# EAGLE schematic OOBD-Tiger_ISO-CAN (EAGLE 6.4)

## Sheet 1 of 6
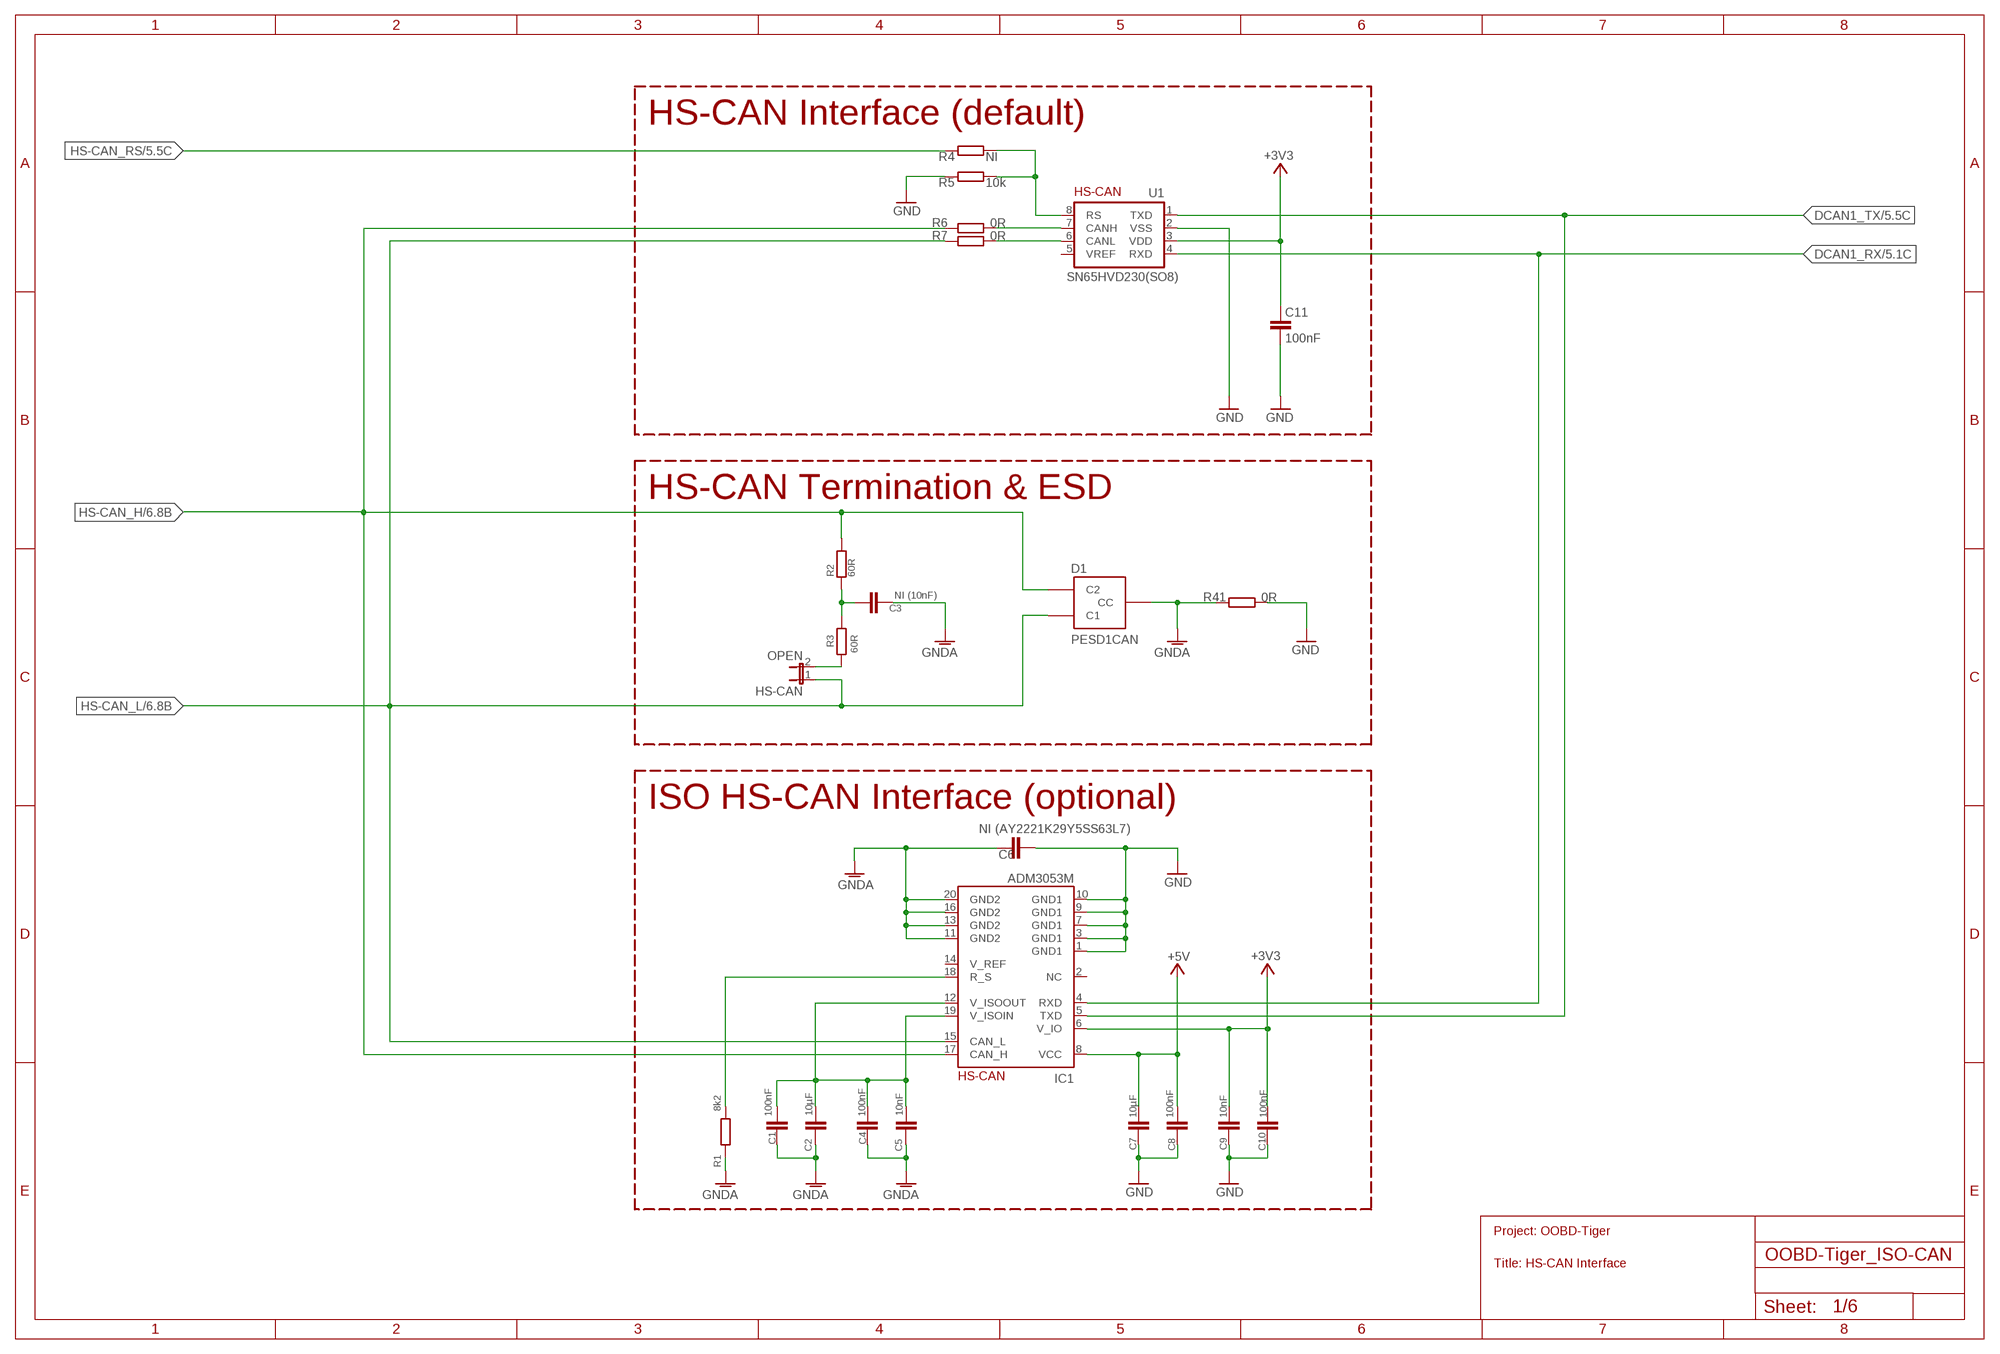
[diagram p0: schematic, sheet 1]

### Parts
C1  100nF  C-EUC0603K  [C0603K]
C2  10µF  C-EUC0805K  [C0805K]
C3  NI (10nF)  C-EUC0603  [C0603]
C4  100nF  C-EUC0603K  [C0603K]
C5  10nF  C-EUC0805K  [C0805K]
C6  NI (AY2221K29Y5SS63L7)  C-EU075-032X103  [C075-032X103]
C7  10µF  C-EUC0805K  [C0805K]
C8  100nF  C-EUC0603K  [C0603K]
C9  10nF  C-EUC0805K  [C0805K]
C10  100nF  C-EUC0603K  [C0603K]
C11  100nF  C-EUC0603K  [C0603K]
D1  PESD1CAN  [SOT23]
HS-CAN  OPEN  JUMPER-2PTH  [1X02]
IC1  ADM3053M  [SO20W]
R1  8k2  R-EU_R0603  [R0603]
R2  60R  R-EU_R0603  [R0603]
R3  60R  R-EU_R0603  [R0603]
R4  NI  R-EU_R0603  [R0603]
R5  10k  R-EU_R0603  [R0603]
R6  0R  R-EU_0207/10  [0207/10]
R7  0R  R-EU_0207/10  [0207/10]
R41  0R  R-EU_0207/10  [0207/10]
U1  SN65HVD230(SO8)  MCP2551  [SO-08]

### Nets
+3V3: C9.1 C10.1 C11.1 IC1.6(V_IO) U1.3(VDD) ; also sheet 2,4,6
+5V: C7.1 C8.1 IC1.8(VCC) ; also sheet 2,3,4,5,6
DCAN1_RX: IC1.4(RXD) U1.4(RXD) ; also sheet 5
DCAN1_TX: IC1.5(TXD) U1.1(TXD) ; also sheet 5
GND [PWR]: C6.2 C7.2 C8.2 C9.2 C10.2 C11.2 IC1.1(GND1) IC1.3(GND1) IC1.7(GND1) IC1.9(GND1) IC1.10(GND1) R5.2 R41.1 U1.2(VSS) ; also sheet 2,3,4,5,6
GNDA [PWR]: C1.2 C2.2 C3.2 C4.2 C5.2 C6.1 D1.3(CC) IC1.11(GND2) IC1.13(GND2) IC1.16(GND2) IC1.20(GND2) R1.1 R41.2 ; also sheet 2
HS-CAN_H: D1.2(C2) IC1.17(CAN_H) R2.2 R6.2 ; also sheet 6
HS-CAN_L: D1.1(C1) HS-CAN.1 IC1.15(CAN_L) R7.1 ; also sheet 6
HS-CAN_RS: R4.2 ; also sheet 5
N$2: C3.1 R2.1 R3.1
N$5: R4.1 R5.1 U1.8(RS)
N$30: HS-CAN.2 R3.2
N$31: C1.1 C2.1 C4.1 C5.1 IC1.12(V_ISOOUT) IC1.19(V_ISOIN)
N$41: R7.2 U1.6(CANL)
N$45: R6.1 U1.7(CANH)
N$52: IC1.18(R_S) R1.2
Unconnected: IC1.2(NC) IC1.14(V_REF) U1.5(VREF)

### Notes on the sheet
- HS-CAN Interface (default)
- HS-CAN
- HS-CAN Termination & ESD
- DCAN0_TX
- DCAN0_RX
- ISO HS-CAN Interface (optional)
- HS-CAN
- Project: OOBD-Tiger
- Title: HS-CAN Interface

## Sheet 2 of 6
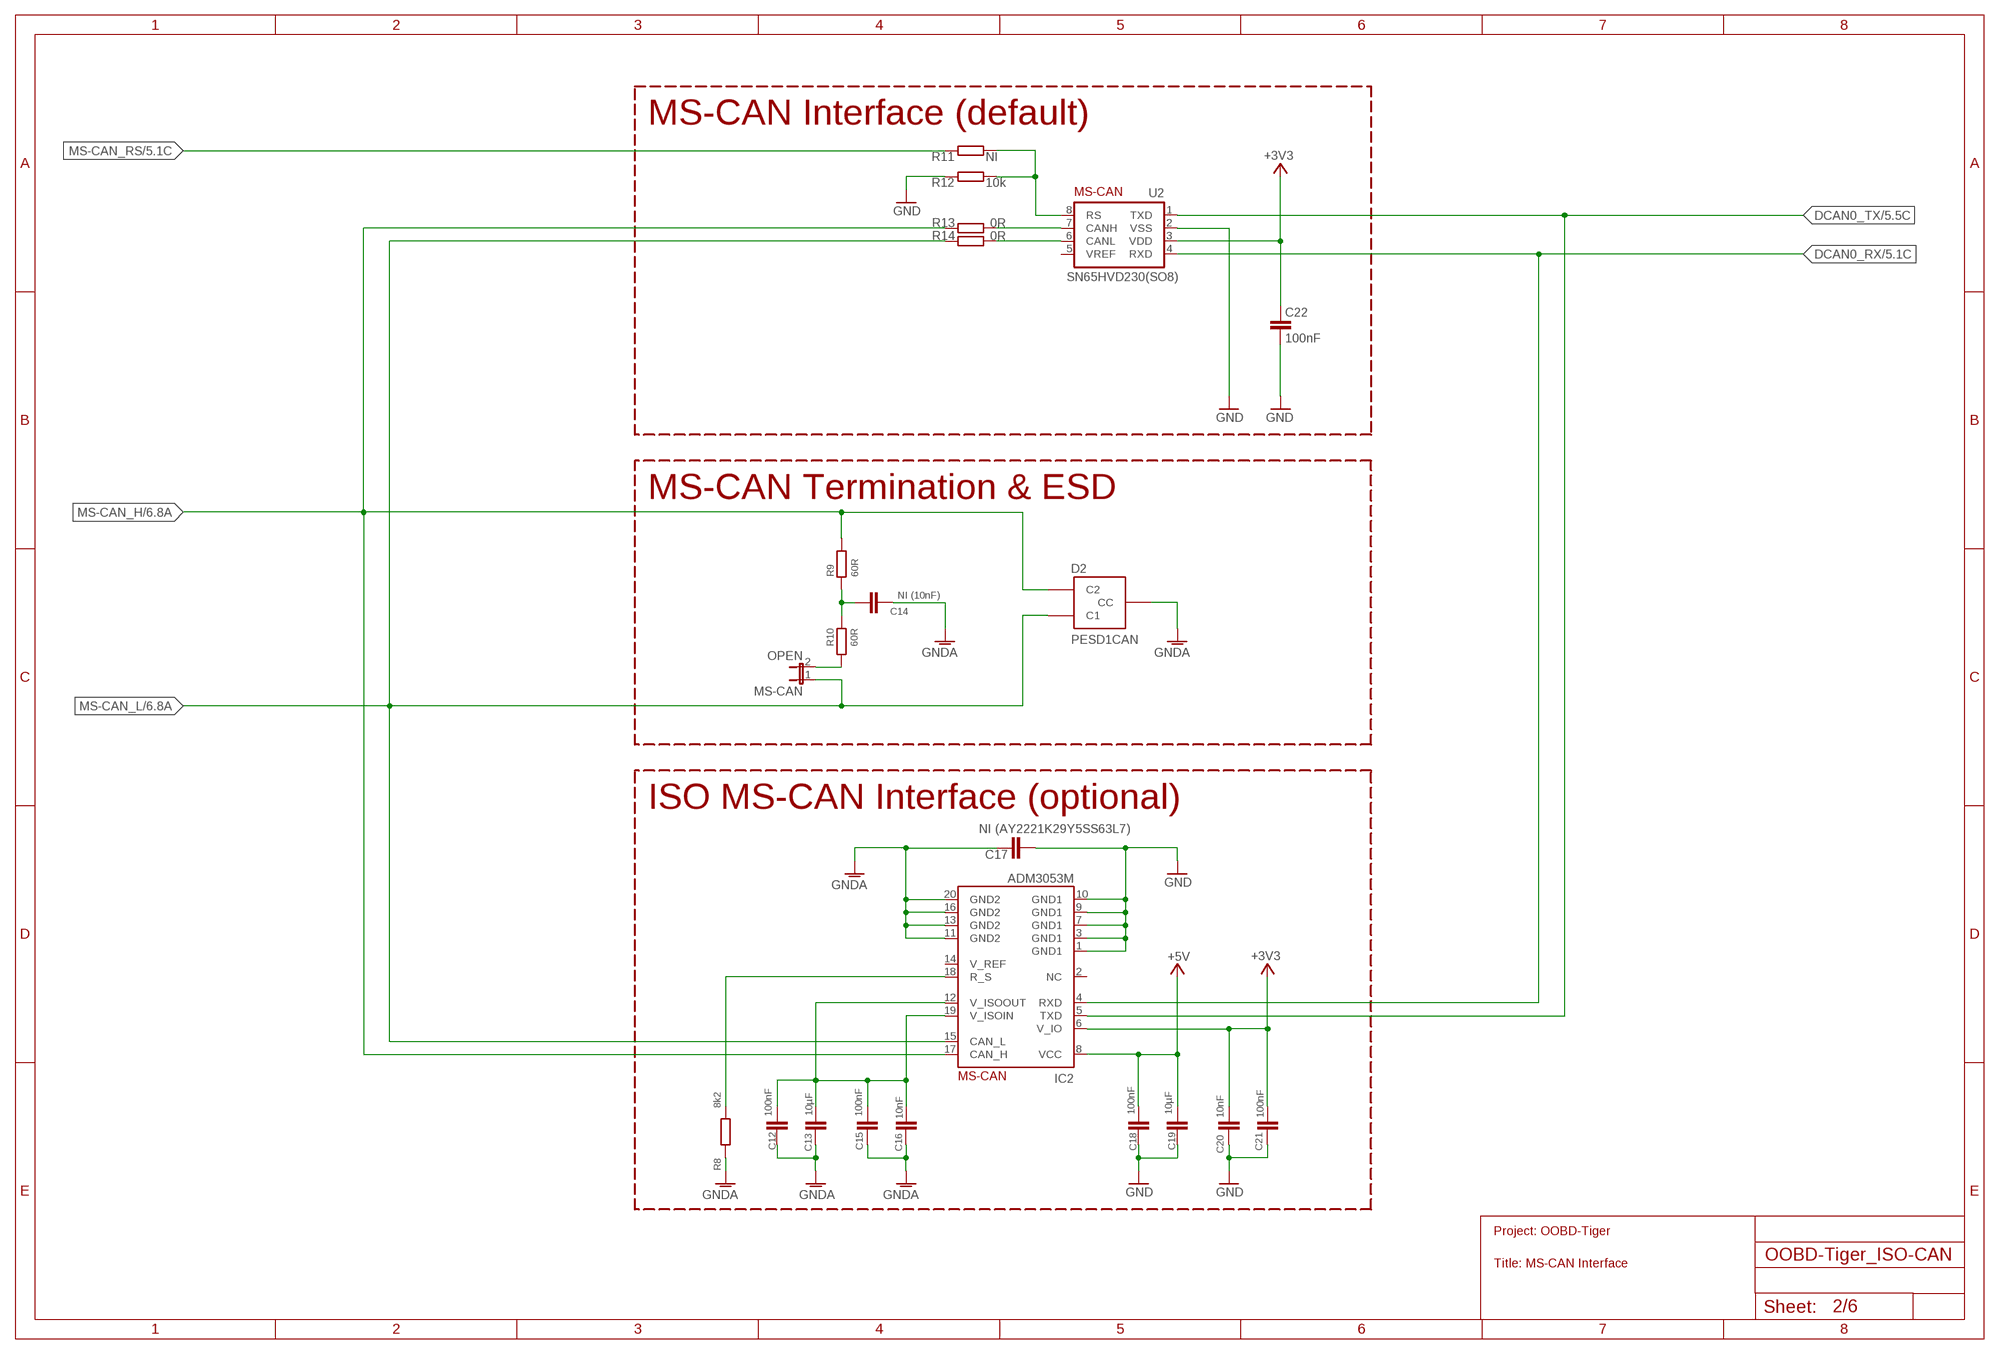
[diagram p1: schematic, sheet 2]

### Parts
C12  100nF  C-EUC0603K  [C0603K]
C13  10µF  C-EUC0805K  [C0805K]
C14  NI (10nF)  C-EUC0603  [C0603]
C15  100nF  C-EUC0603K  [C0603K]
C16  10nF  C-EUC0805K  [C0805K]
C17  NI (AY2221K29Y5SS63L7)  C-EU075-032X103  [C075-032X103]
C18  100nF  C-EUC0603K  [C0603K]
C19  10µF  C-EUC0805K  [C0805K]
C20  10nF  C-EUC0805K  [C0805K]
C21  100nF  C-EUC0603K  [C0603K]
C22  100nF  C-EUC0603K  [C0603K]
D2  PESD1CAN  [SOT23]
IC2  ADM3053M  [SO20W]
MS-CAN  OPEN  JUMPER-2PTH  [1X02]
R8  8k2  R-EU_R0603  [R0603]
R9  60R  R-EU_R0603  [R0603]
R10  60R  R-EU_R0603  [R0603]
R11  NI  R-EU_R0603  [R0603]
R12  10k  R-EU_R0603  [R0603]
R13  0R  R-EU_0207/10  [0207/10]
R14  0R  R-EU_0207/10  [0207/10]
U2  SN65HVD230(SO8)  MCP2551  [SO-08]

### Nets
+3V3: C20.1 C21.1 C22.1 IC2.6(V_IO) U2.3(VDD) ; also sheet 1,4,6
+5V: C18.1 C19.1 IC2.8(VCC) ; also sheet 1,3,4,5,6
DCAN0_RX: IC2.4(RXD) U2.4(RXD) ; also sheet 5
DCAN0_TX: IC2.5(TXD) U2.1(TXD) ; also sheet 5
GND [PWR]: C17.2 C18.2 C19.2 C20.2 C21.2 C22.2 IC2.1(GND1) IC2.3(GND1) IC2.7(GND1) IC2.9(GND1) IC2.10(GND1) R12.2 U2.2(VSS) ; also sheet 1,3,4,5,6
GNDA [PWR]: C12.2 C13.2 C14.2 C15.2 C16.2 C17.1 D2.3(CC) IC2.11(GND2) IC2.13(GND2) IC2.16(GND2) IC2.20(GND2) R8.1 ; also sheet 1
MS-CAN_H: D2.2(C2) IC2.17(CAN_H) R9.2 R13.1 ; also sheet 6
MS-CAN_L: D2.1(C1) IC2.15(CAN_L) MS-CAN.1 R14.1 ; also sheet 6
MS-CAN_RS: R11.2 ; also sheet 5
N$10: C14.1 R9.1 R10.1
N$32: MS-CAN.2 R10.2
N$33: IC2.18(R_S) R8.2
N$40: R13.2 U2.7(CANH)
N$42: R14.2 U2.6(CANL)
N$50: C12.1 C13.1 C15.1 C16.1 IC2.12(V_ISOOUT) IC2.19(V_ISOIN)
N$80: R11.1 R12.1 U2.8(RS)
Unconnected: IC2.2(NC) IC2.14(V_REF) U2.5(VREF)

### Notes on the sheet
- MS-CAN Interface (default)
- MS-CAN
- MS-CAN Termination & ESD
- ISO MS-CAN Interface (optional)
- MS-CAN
- Project: OOBD-Tiger
- Title: MS-CAN Interface

## Sheet 3 of 6
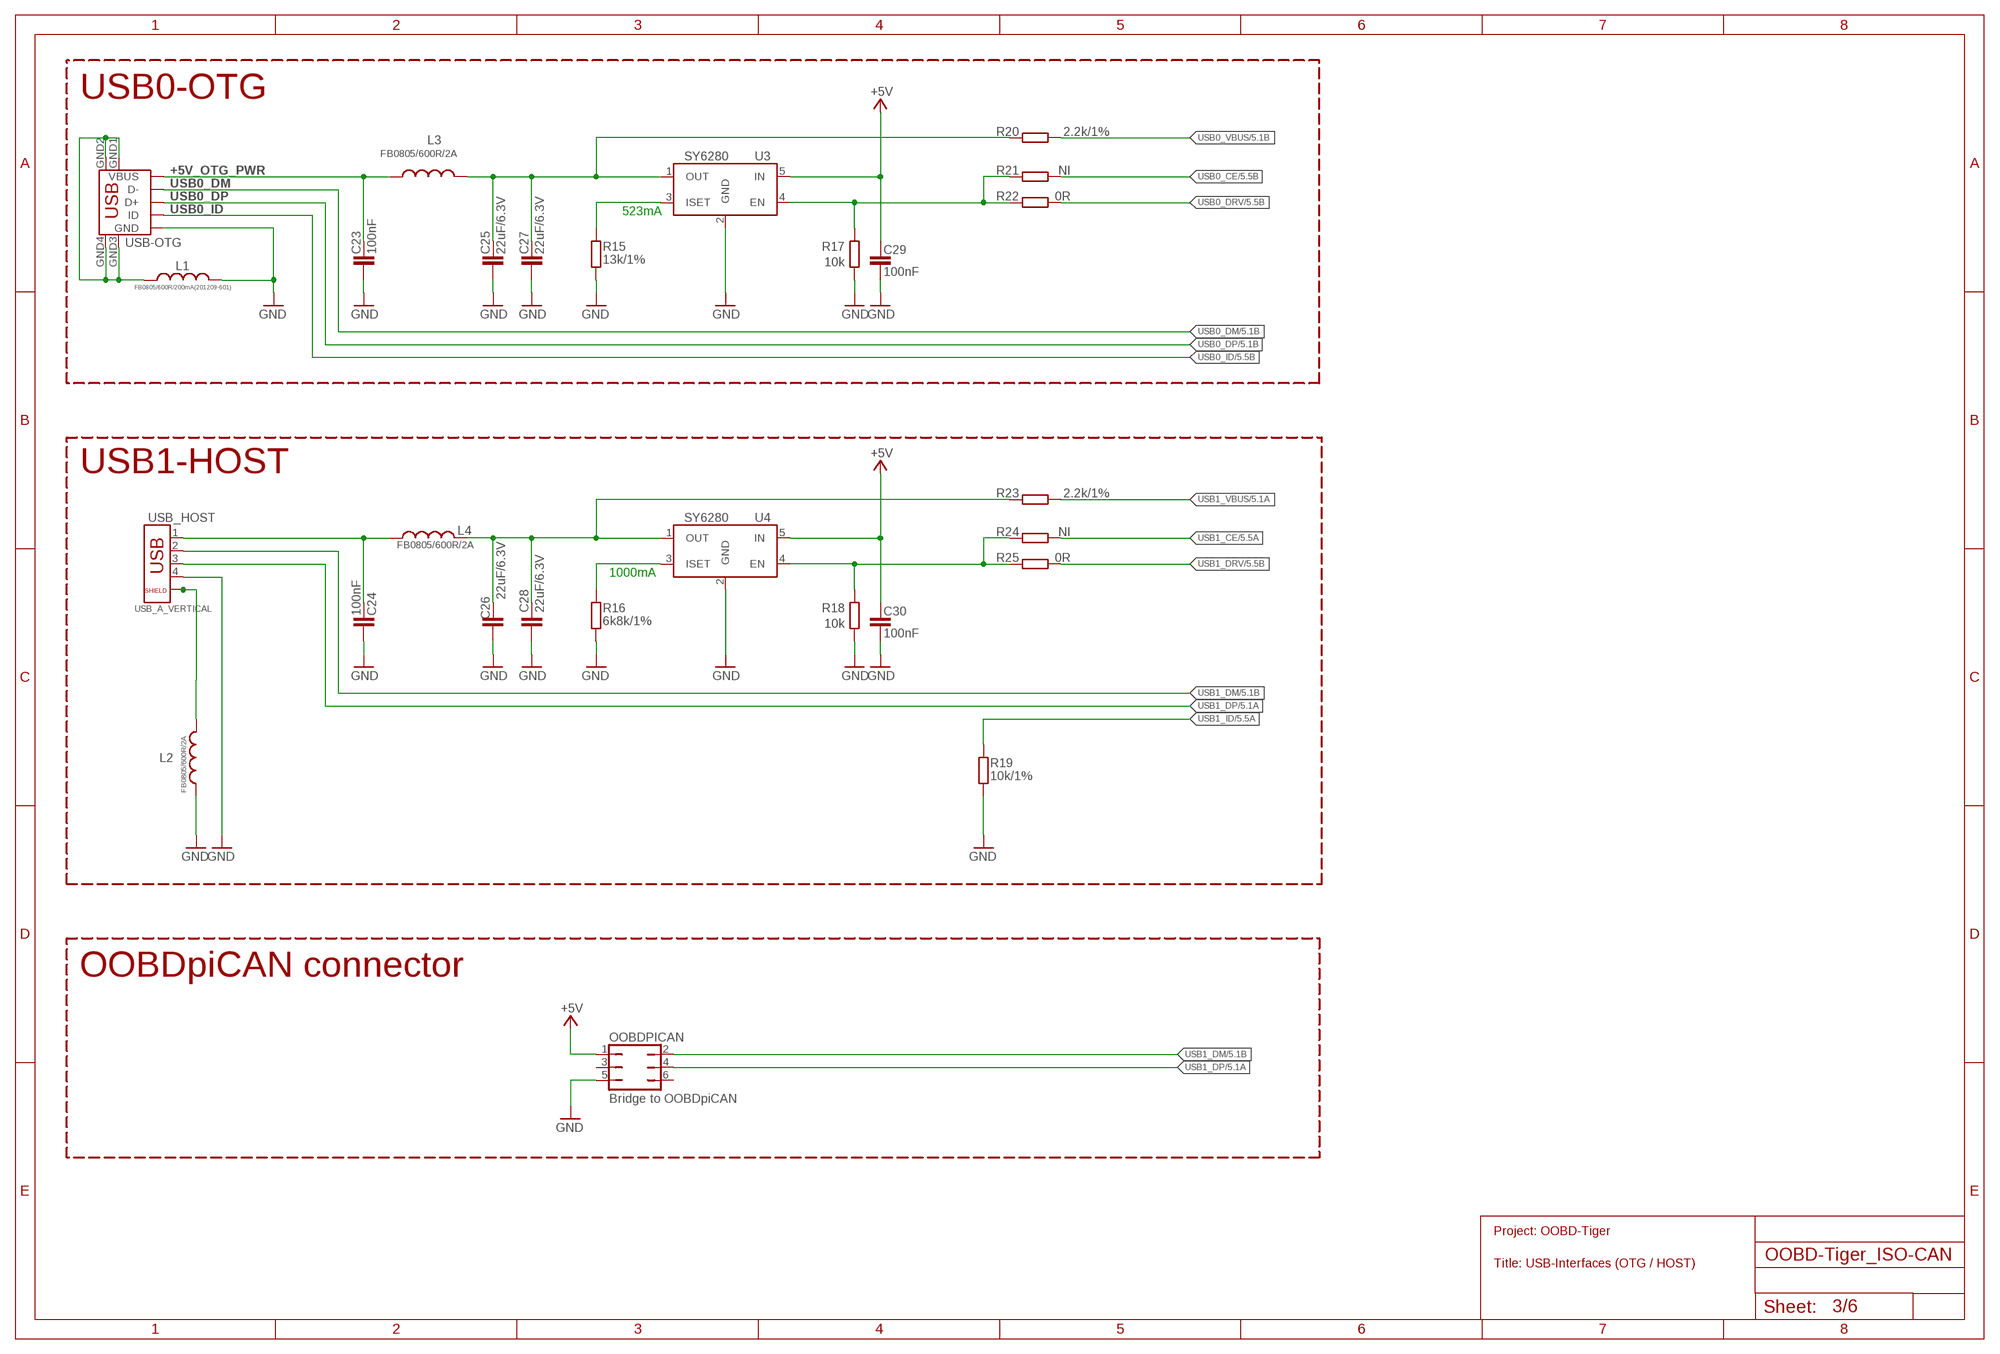
[diagram p2: schematic, sheet 3]

### Parts
C23  100nF  C-EUC0603K  [C0603K]
C24  100nF  C-EUC0603K  [C0603K]
C25  22uF/6.3V  C-EUC0603  [C0603]
C26  22uF/6.3V  C-EUC0603  [C0603]
C27  22uF/6.3V  C-EUC0603  [C0603]
C28  22uF/6.3V  C-EUC0603  [C0603]
C29  100nF  C-EUC0603K  [C0603K]
C30  100nF  C-EUC0603K  [C0603K]
L1  FB0805/600R/200mA(201209-601)  L-USL0603  [L0603]
L2  FB0805/600R/2A  L-USL0603  [L0603]
L3  FB0805/600R/2A  L-USL0603  [L0603]
L4  FB0805/600R/2A  L-USL0603  [L0603]
OOBDPICAN  Bridge to OOBDpiCAN  JP3Q  [JP3Q]
R15  13k/1%  R-EU_R0603  [R0603]
R16  6k8k/1%  R-EU_R0603  [R0603]
R17  10k  R-EU_R0603  [R0603]
R18  10k  R-EU_R0603  [R0603]
R19  10k/1%  R-EU_R0603  [R0603]
R20  2.2k/1%  R-EU_R0603  [R0603]
R21  NI  R-EU_R0603  [R0603]
R22  0R  R-EU_R0603  [R0603]
R23  2.2k/1%  R-EU_R0603  [R0603]
R24  NI  R-EU_R0603  [R0603]
R25  0R  R-EU_R0603  [R0603]
U3  SY6280  [SOT23-5]
U4  SY6280  [SOT23-5]
USB_HOST  USB_A_VERTICAL  USB_SHIELD1  [USB_PN87520_DEV_PTH]
USB_OTG  USB-OTG  MINI_USB9  [USB_MINI_9PIN]

### Nets
+5V: C29.1 C30.1 OOBDPICAN.1 U3.5(IN) U4.5(IN) ; also sheet 1,2,4,5,6
+5V_OTG_PWR: C23.1 L3.1 USB_OTG.VBUS
GND [PWR]: C23.2 C24.2 C25.2 C26.2 C27.2 C28.2 C29.2 C30.2 L1.1 L2.1 OOBDPICAN.5 R15.1 R16.1 R17.1 R18.1 R19.1 U3.2(GND) U4.2(GND) USB_HOST.4 USB_OTG.GND ; also sheet 1,2,4,5,6
N$3: R16.2 U4.3(ISET)
N$13: C26.1 C28.1 L4.1 R23.2 U4.1(OUT)
N$28: C24.1 L4.2 USB_HOST.1
N$29: L2.2 USB_HOST.P$1 USB_HOST.P$2
N$99: R15.2 U3.3(ISET)
N$100: C25.1 C27.1 L3.2 R20.2 U3.1(OUT)
N$266: L1.2 USB_OTG.GND1 USB_OTG.GND2 USB_OTG.GND3 USB_OTG.GND4
USB0_CE: R21.2 ; also sheet 5
USB0_DM: USB_OTG.D- ; also sheet 5
USB0_DP: USB_OTG.D+ ; also sheet 5
USB0_DRV: R22.2 ; also sheet 5
USB0_EN: R17.2 R21.1 R22.1 U3.4(EN)
USB0_ID: USB_OTG.ID ; also sheet 5
USB0_VBUS: R20.1 ; also sheet 5
USB1_CE: R24.2 ; also sheet 5
USB1_DM: OOBDPICAN.2 USB_HOST.2 ; also sheet 5
USB1_DP: OOBDPICAN.4 USB_HOST.3 ; also sheet 5
USB1_DRV: R25.2 ; also sheet 5
USB1_EN: R18.2 R24.1 R25.1 U4.4(EN)
USB1_ID: R19.2 ; also sheet 5
USB1_VBUS: R23.1 ; also sheet 5
Unconnected: OOBDPICAN.3 OOBDPICAN.6

### Notes on the sheet
- USB0-OTG
- 523mA
- Iset = 6800/Rs
- Rs
- Iset = 523mA
- USB1-HOST
- 1000mA
- OOBDpiCAN connector
- Project: OOBD-Tiger
- Title: USB-Interfaces (OTG / HOST)

## Sheet 4 of 6
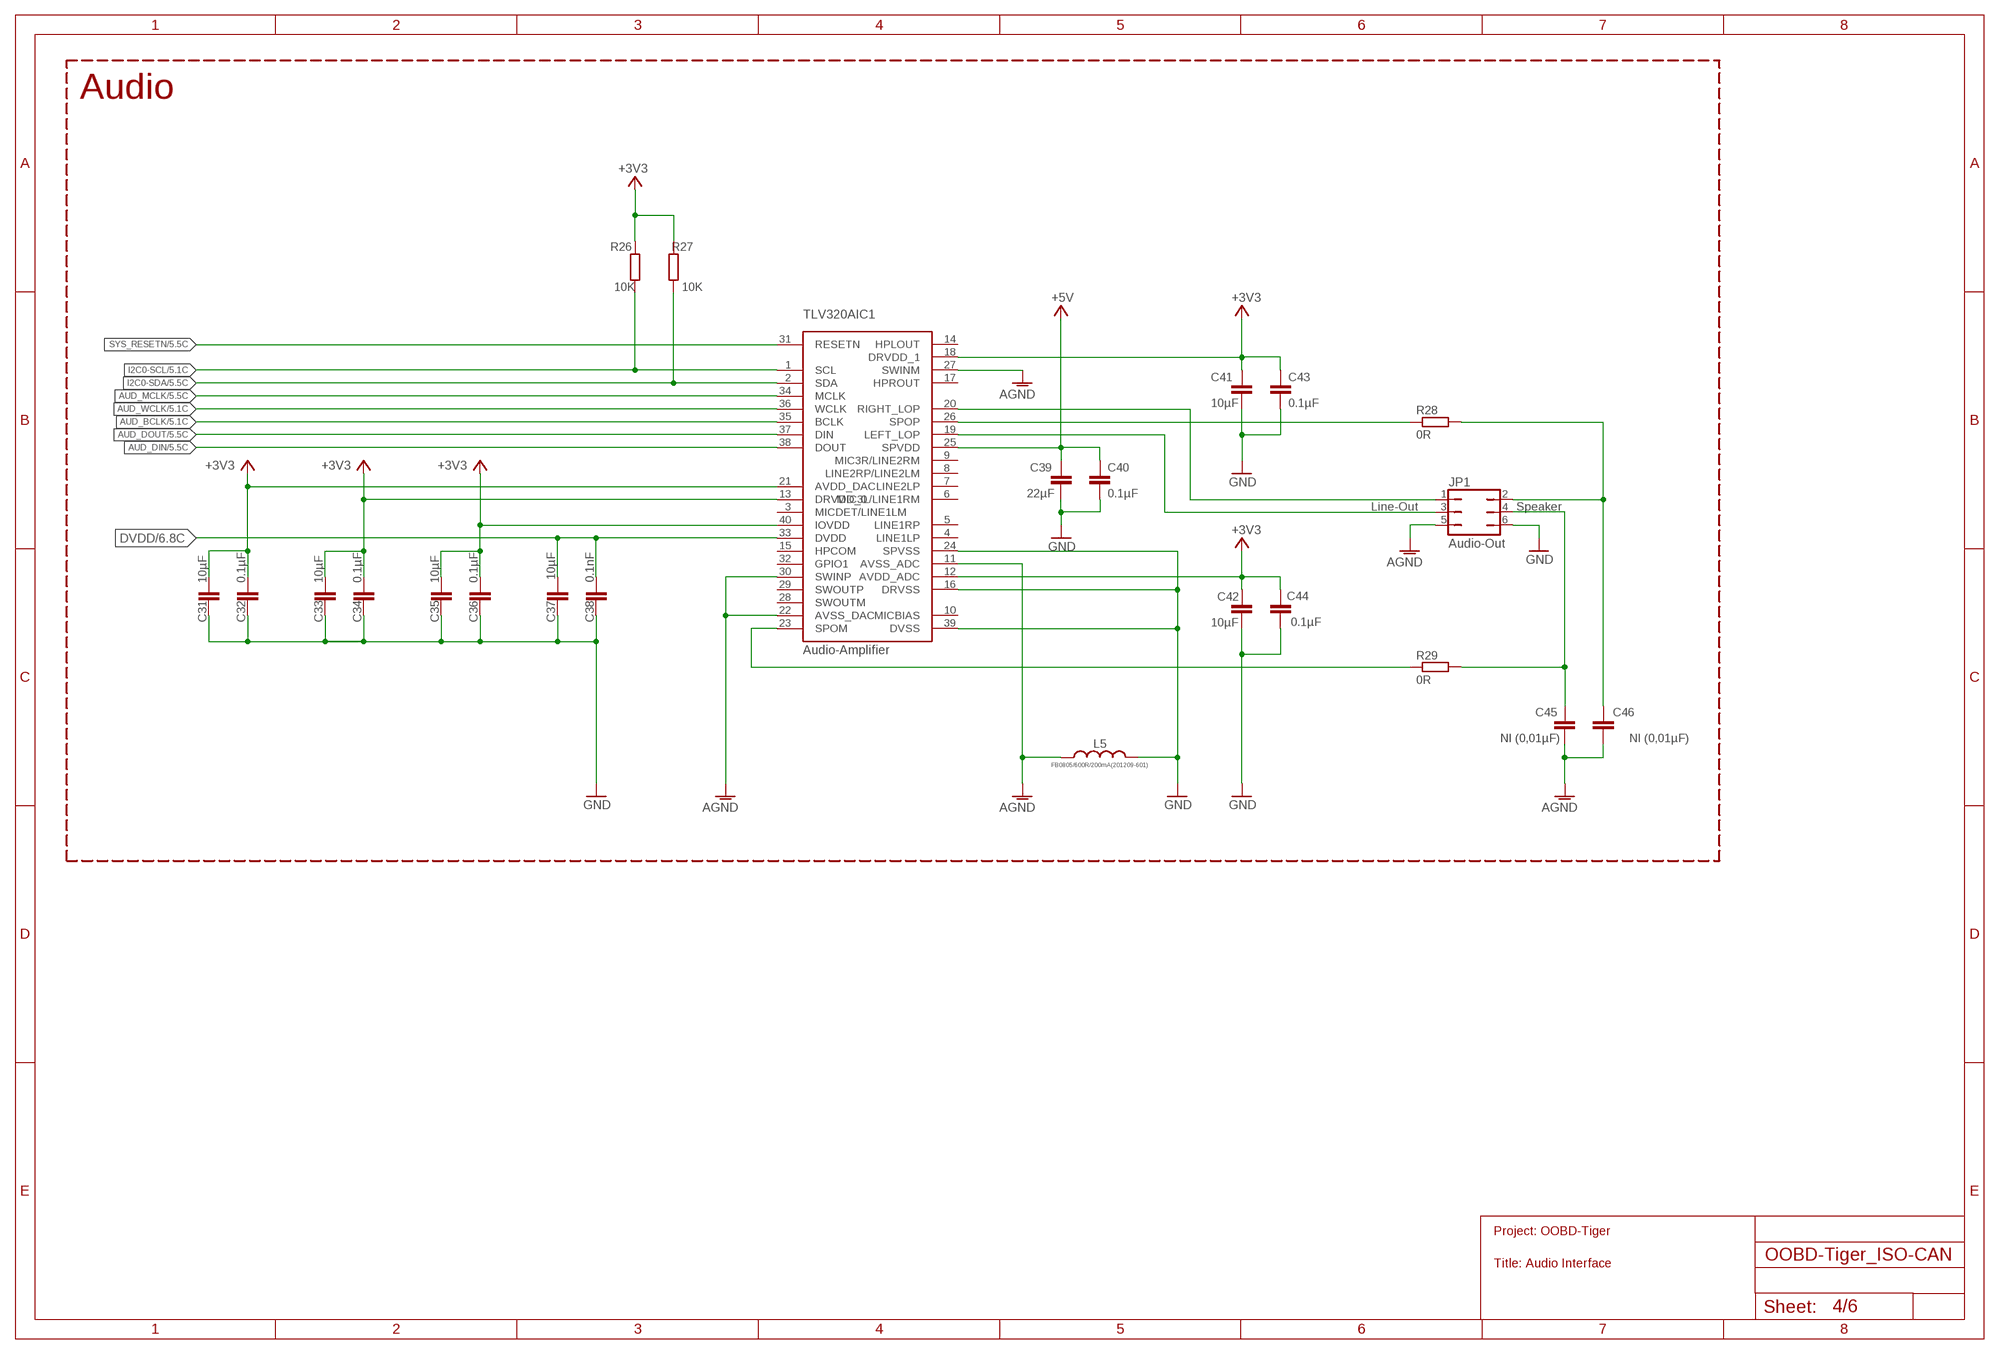
[diagram p3: schematic, sheet 4]

### Parts
C31  10µF  CAP0603-CAP  [0603-CAP]
C32  0.1µF  CAP0603-CAP  [0603-CAP]
C33  10µF  CAP0603-CAP  [0603-CAP]
C34  0.1µF  CAP0603-CAP  [0603-CAP]
C35  10µF  CAP0603-CAP  [0603-CAP]
C36  0.1µF  CAP0603-CAP  [0603-CAP]
C37  10µF  CAP0603-CAP  [0603-CAP]
C38  0.1nF  CAP0603-CAP  [0603-CAP]
C39  22µF  CAP0603-CAP  [0603-CAP]
C40  0.1µF  CAP0603-CAP  [0603-CAP]
C41  10µF  CAP0603-CAP  [0603-CAP]
C42  10µF  CAP0603-CAP  [0603-CAP]
C43  0.1µF  CAP0603-CAP  [0603-CAP]
C44  0.1µF  CAP0603-CAP  [0603-CAP]
C45  NI (0,01µF)  CAP0603-CAP  [0603-CAP]
C46  NI (0,01µF)  CAP0603-CAP  [0603-CAP]
JP1  Audio-Out  JP3Q  [JP3Q]
L5  FB0805/600R/200mA(201209-601)  L-USL0603  [L0603]
R26  10K  R-EU_R0603  [R0603]
R27  10K  R-EU_R0603  [R0603]
R28  0R  R-EU_R0805  [R0805]
R29  0R  R-EU_R0805  [R0805]
TLV320AIC1  Audio-Amplifier  TLV320AIC3107  [QFN40-6X6]

### Nets
+3V3: C31.2 C32.2 C33.2 C34.2 C35.2 C36.2 C41.1 C42.1 C43.1 C44.1 R26.2 R27.2 TLV320AIC1.12(AVDD_ADC) TLV320AIC1.13(DRVDD_0) TLV320AIC1.18(DRVDD_1) TLV320AIC1.21(AVDD_DAC) TLV320AIC1.40(IOVDD) ; also sheet 1,2,6
+5V: C39.2 C40.2 TLV320AIC1.25(SPVDD) ; also sheet 1,2,3,5,6
AGND: C45.1 C46.1 JP1.5 L5.2 TLV320AIC1.11(AVSS_ADC) TLV320AIC1.22(AVSS_DAC) TLV320AIC1.27(SWINM) TLV320AIC1.30(SWINP)
AUD_BCLK: TLV320AIC1.35(BCLK) ; also sheet 5
AUD_DIN: TLV320AIC1.38(DOUT) ; also sheet 5
AUD_DOUT: TLV320AIC1.37(DIN) ; also sheet 5
AUD_MCLK: TLV320AIC1.34(MCLK) ; also sheet 5
AUD_WCLK: TLV320AIC1.36(WCLK) ; also sheet 5
DVDD: C37.2 C38.2 TLV320AIC1.33(DVDD) ; also sheet 6
GND [PWR]: C31.1 C32.1 C33.1 C34.1 C35.1 C36.1 C37.1 C38.1 C39.1 C40.1 C41.2 C42.2 C43.2 C44.2 JP1.6 L5.1 TLV320AIC1.16(DRVSS) TLV320AIC1.24(SPVSS) TLV320AIC1.39(DVSS) ; also sheet 1,2,3,5,6
I2C0-SCL: R26.1 TLV320AIC1.1(SCL) ; also sheet 5,6
I2C0-SDA: R27.1 TLV320AIC1.2(SDA) ; also sheet 5,6
N$14: JP1.1 TLV320AIC1.20(RIGHT_LOP)
N$15: C45.2 JP1.4 R29.2
N$16: C46.2 JP1.2 R28.2
N$17 [PWR]: R28.1 TLV320AIC1.26(SPOP)
N$18: R29.1 TLV320AIC1.23(SPOM)
N$19: JP1.3 TLV320AIC1.19(LEFT_LOP)
SYS_RESETN: TLV320AIC1.31(RESETN) ; also sheet 5,6
Unconnected: TLV320AIC1.3(MICDET/LINE1LM) TLV320AIC1.4(LINE1LP) TLV320AIC1.5(LINE1RP) TLV320AIC1.6(MIC3L/LINE1RM) TLV320AIC1.7(LINE2LP) TLV320AIC1.8(LINE2RP/LINE2LM) TLV320AIC1.9(MIC3R/LINE2RM) TLV320AIC1.10(MICBIAS) TLV320AIC1.14(HPLOUT) TLV320AIC1.15(HPCOM) TLV320AIC1.17(HPROUT) TLV320AIC1.28(SWOUTM) TLV320AIC1.29(SWOUTP) TLV320AIC1.32(GPIO1)

### Notes on the sheet
- Audio
- Line-Out | Speaker
- Project: OOBD-Tiger
- Title: Audio Interface

## Sheet 5 of 6
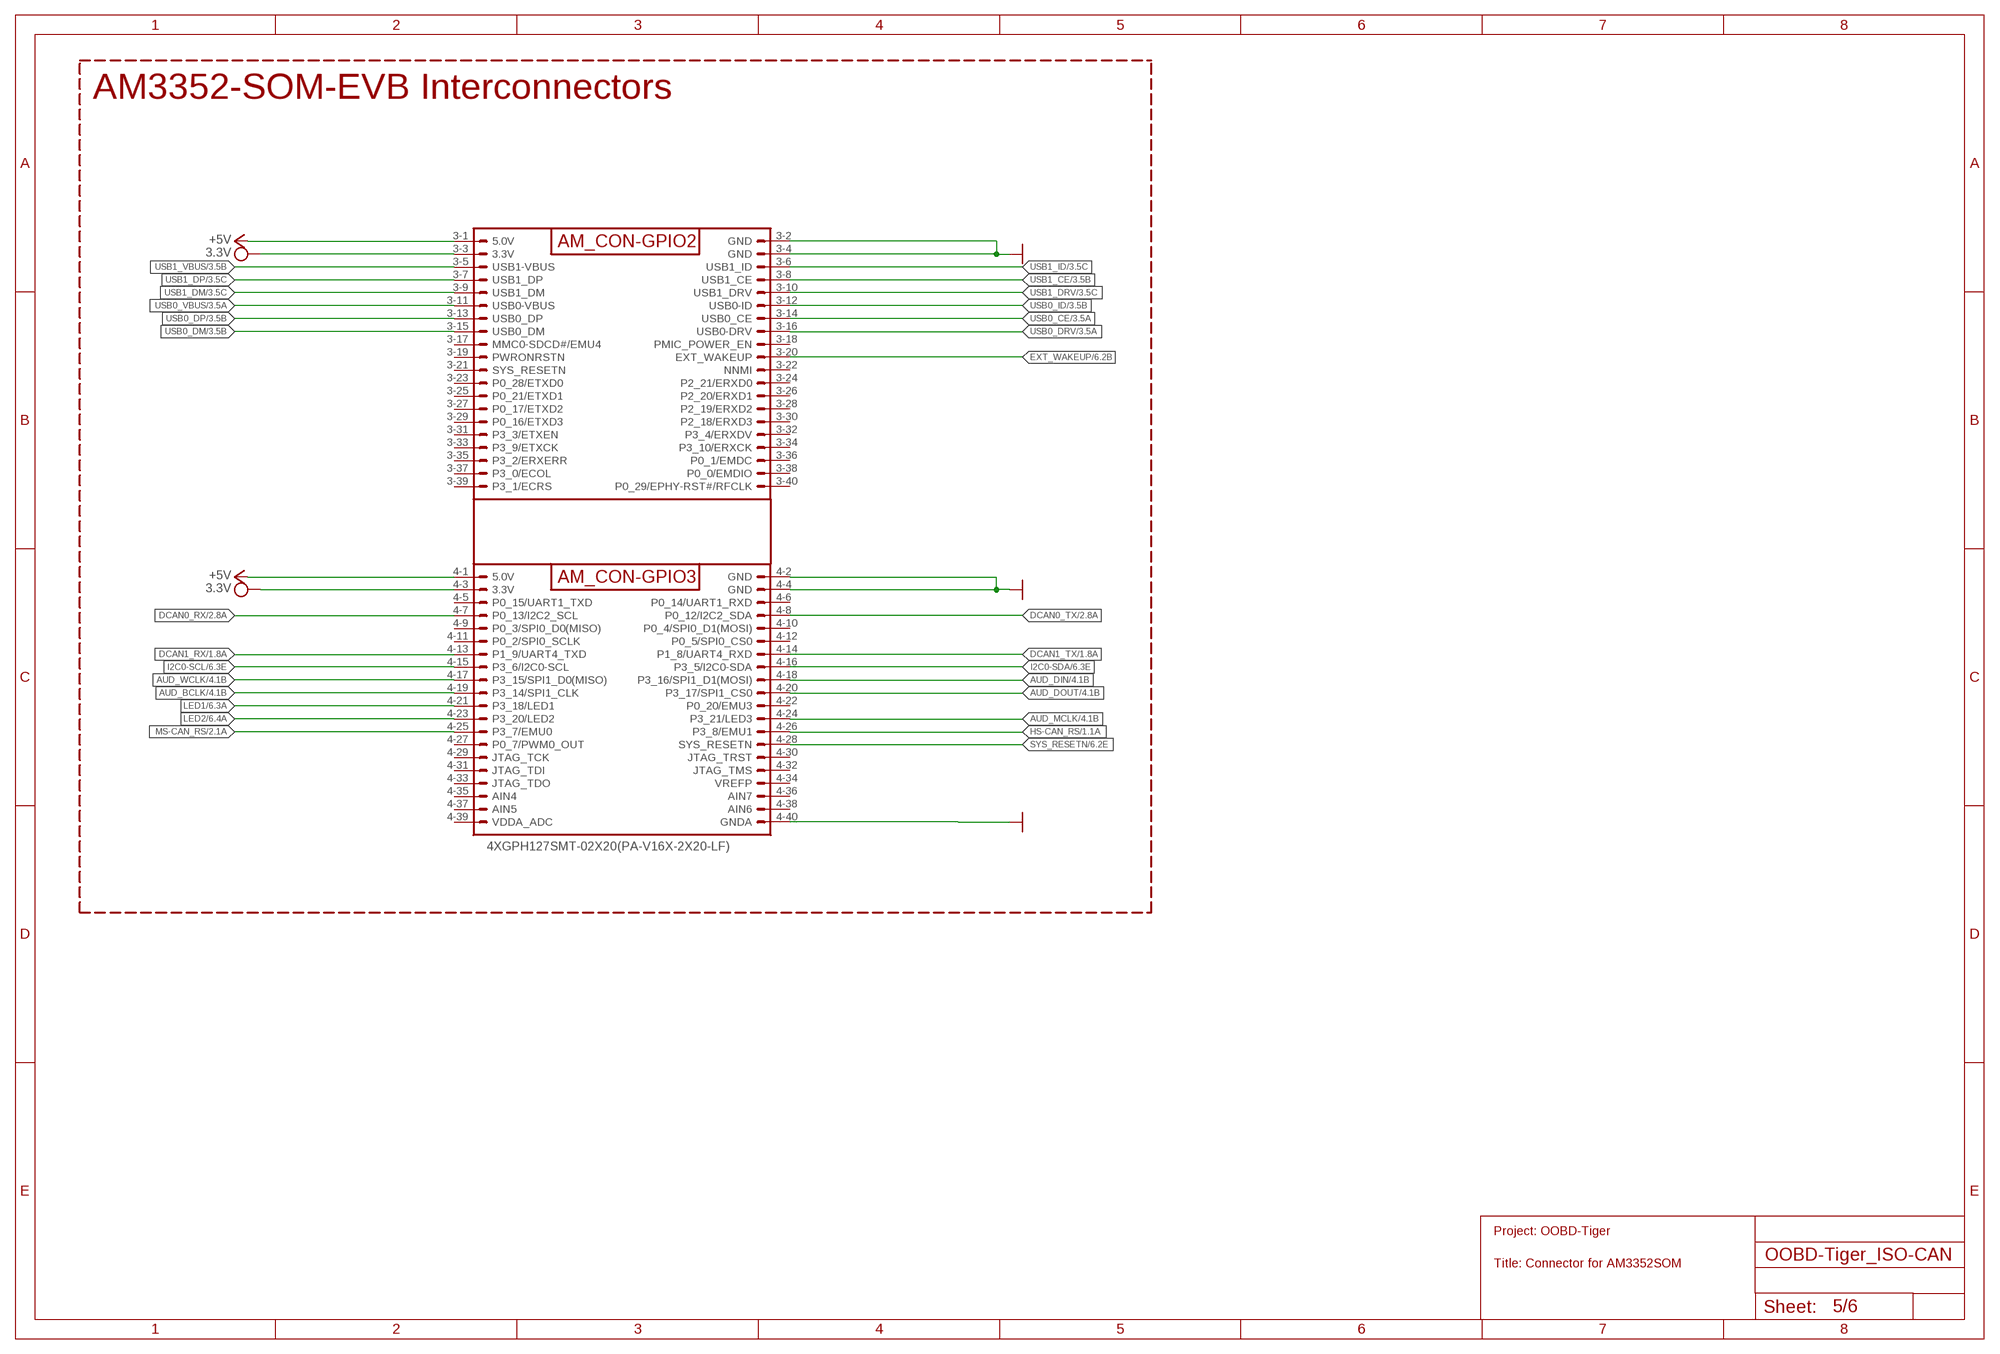
[diagram p4: schematic, sheet 5]

### Parts
AM3352-SOM-EVB-PLATFORM  4XGPH127SMT-02X20(PA-V16X-2X20-LF)  OOBD-TIGER-AM3352-SOM---4XGPH127SMT-02X20(PA-V16X-2X20-LF)  [OOBD-TIGER-AM3352-SOM]

### Nets
3V3 [PWR]: AM3352-SOM-EVB-PLATFORM.3-3(3.3V) AM3352-SOM-EVB-PLATFORM.4-3(3.3V) ; supply symbol labelled 3.3V
+5V: AM3352-SOM-EVB-PLATFORM.3-1(5.0V) AM3352-SOM-EVB-PLATFORM.4-1(5.0V) ; also sheet 1,2,3,4,6
AUD_BCLK: AM3352-SOM-EVB-PLATFORM.4-19(P3_14/SPI1_CLK) ; also sheet 4
AUD_DIN: AM3352-SOM-EVB-PLATFORM.4-18(P3_16/SPI1_D1(MOSI)) ; also sheet 4
AUD_DOUT: AM3352-SOM-EVB-PLATFORM.4-20(P3_17/SPI1_CS0) ; also sheet 4
AUD_MCLK: AM3352-SOM-EVB-PLATFORM.4-24(P3_21/LED3) ; also sheet 4
AUD_WCLK: AM3352-SOM-EVB-PLATFORM.4-17(P3_15/SPI1_D0(MISO)) ; also sheet 4
DCAN0_RX: AM3352-SOM-EVB-PLATFORM.4-7(P0_13/I2C2_SCL) ; also sheet 2
DCAN0_TX: AM3352-SOM-EVB-PLATFORM.4-8(P0_12/I2C2_SDA) ; also sheet 2
DCAN1_RX: AM3352-SOM-EVB-PLATFORM.4-13(P1_9/UART4_TXD) ; also sheet 1
DCAN1_TX: AM3352-SOM-EVB-PLATFORM.4-14(P1_8/UART4_RXD) ; also sheet 1
EXT_WAKEUP: AM3352-SOM-EVB-PLATFORM.3-20(EXT_WAKEUP) ; also sheet 6
GND [PWR]: AM3352-SOM-EVB-PLATFORM.3-2(GND) AM3352-SOM-EVB-PLATFORM.3-4(GND) AM3352-SOM-EVB-PLATFORM.4-2(GND) AM3352-SOM-EVB-PLATFORM.4-4(GND) AM3352-SOM-EVB-PLATFORM.4-40(GNDA) ; also sheet 1,2,3,4,6
HS-CAN_RS: AM3352-SOM-EVB-PLATFORM.4-26(P3_8/EMU1) ; also sheet 1
I2C0-SCL: AM3352-SOM-EVB-PLATFORM.4-15(P3_6/I2C0-SCL) ; also sheet 4,6
I2C0-SDA: AM3352-SOM-EVB-PLATFORM.4-16(P3_5/I2C0-SDA) ; also sheet 4,6
LED1: AM3352-SOM-EVB-PLATFORM.4-21(P3_18/LED1) ; also sheet 6
LED2: AM3352-SOM-EVB-PLATFORM.4-23(P3_20/LED2) ; also sheet 6
MS-CAN_RS: AM3352-SOM-EVB-PLATFORM.4-25(P3_7/EMU0) ; also sheet 2
SYS_RESETN: AM3352-SOM-EVB-PLATFORM.4-28(SYS_RESETN) ; also sheet 4,6
USB0_CE: AM3352-SOM-EVB-PLATFORM.3-14(USB0_CE) ; also sheet 3
USB0_DM: AM3352-SOM-EVB-PLATFORM.3-15(USB0_DM) ; also sheet 3
USB0_DP: AM3352-SOM-EVB-PLATFORM.3-13(USB0_DP) ; also sheet 3
USB0_DRV: AM3352-SOM-EVB-PLATFORM.3-16(USB0-DRV) ; also sheet 3
USB0_ID: AM3352-SOM-EVB-PLATFORM.3-12(USB0-ID) ; also sheet 3
USB0_VBUS: AM3352-SOM-EVB-PLATFORM.3-11(USB0-VBUS) ; also sheet 3
USB1_CE: AM3352-SOM-EVB-PLATFORM.3-8(USB1_CE) ; also sheet 3
USB1_DM: AM3352-SOM-EVB-PLATFORM.3-9(USB1_DM) ; also sheet 3
USB1_DP: AM3352-SOM-EVB-PLATFORM.3-7(USB1_DP) ; also sheet 3
USB1_DRV: AM3352-SOM-EVB-PLATFORM.3-10(USB1_DRV) ; also sheet 3
USB1_ID: AM3352-SOM-EVB-PLATFORM.3-6(USB1_ID) ; also sheet 3
USB1_VBUS: AM3352-SOM-EVB-PLATFORM.3-5(USB1-VBUS) ; also sheet 3
Unconnected: AM3352-SOM-EVB-PLATFORM.3-17(MMC0-SDCD#/EMU4) AM3352-SOM-EVB-PLATFORM.3-18(PMIC_POWER_EN) AM3352-SOM-EVB-PLATFORM.3-19(PWRONRSTN) AM3352-SOM-EVB-PLATFORM.3-21(SYS_RESETN) AM3352-SOM-EVB-PLATFORM.3-22(NNMI) AM3352-SOM-EVB-PLATFORM.3-23(P0_28/ETXD0) AM3352-SOM-EVB-PLATFORM.3-24(P2_21/ERXD0) AM3352-SOM-EVB-PLATFORM.3-25(P0_21/ETXD1) AM3352-SOM-EVB-PLATFORM.3-26(P2_20/ERXD1) AM3352-SOM-EVB-PLATFORM.3-27(P0_17/ETXD2) AM3352-SOM-EVB-PLATFORM.3-28(P2_19/ERXD2) AM3352-SOM-EVB-PLATFORM.3-29(P0_16/ETXD3) AM3352-SOM-EVB-PLATFORM.3-30(P2_18/ERXD3) AM3352-SOM-EVB-PLATFORM.3-31(P3_3/ETXEN) AM3352-SOM-EVB-PLATFORM.3-32(P3_4/ERXDV) AM3352-SOM-EVB-PLATFORM.3-33(P3_9/ETXCK) AM3352-SOM-EVB-PLATFORM.3-34(P3_10/ERXCK) AM3352-SOM-EVB-PLATFORM.3-35(P3_2/ERXERR) AM3352-SOM-EVB-PLATFORM.3-36(P0_1/EMDC) AM3352-SOM-EVB-PLATFORM.3-37(P3_0/ECOL) AM3352-SOM-EVB-PLATFORM.3-38(P0_0/EMDIO) AM3352-SOM-EVB-PLATFORM.3-39(P3_1/ECRS) AM3352-SOM-EVB-PLATFORM.3-40(P0_29/EPHY-RST#/RFCLK) AM3352-SOM-EVB-PLATFORM.4-5(P0_15/UART1_TXD) AM3352-SOM-EVB-PLATFORM.4-6(P0_14/UART1_RXD) AM3352-SOM-EVB-PLATFORM.4-9(P0_3/SPI0_D0(MISO)) AM3352-SOM-EVB-PLATFORM.4-10(P0_4/SPI0_D1(MOSI)) AM3352-SOM-EVB-PLATFORM.4-11(P0_2/SPI0_SCLK) AM3352-SOM-EVB-PLATFORM.4-12(P0_5/SPI0_CS0) AM3352-SOM-EVB-PLATFORM.4-22(P0_20/EMU3) AM3352-SOM-EVB-PLATFORM.4-27(P0_7/PWM0_OUT) AM3352-SOM-EVB-PLATFORM.4-29(JTAG_TCK) AM3352-SOM-EVB-PLATFORM.4-30(JTAG_TRST) AM3352-SOM-EVB-PLATFORM.4-31(JTAG_TDI) AM3352-SOM-EVB-PLATFORM.4-32(JTAG_TMS) AM3352-SOM-EVB-PLATFORM.4-33(JTAG_TDO) AM3352-SOM-EVB-PLATFORM.4-34(VREFP) AM3352-SOM-EVB-PLATFORM.4-35(AIN4) AM3352-SOM-EVB-PLATFORM.4-36(AIN7) AM3352-SOM-EVB-PLATFORM.4-37(AIN5) AM3352-SOM-EVB-PLATFORM.4-38(AIN6) AM3352-SOM-EVB-PLATFORM.4-39(VDDA_ADC)

### Notes on the sheet
- AM3352-SOM-EVB Interconnectors
- Project: OOBD-Tiger
- Title: Connector for AM3352SOM

## Sheet 6 of 6
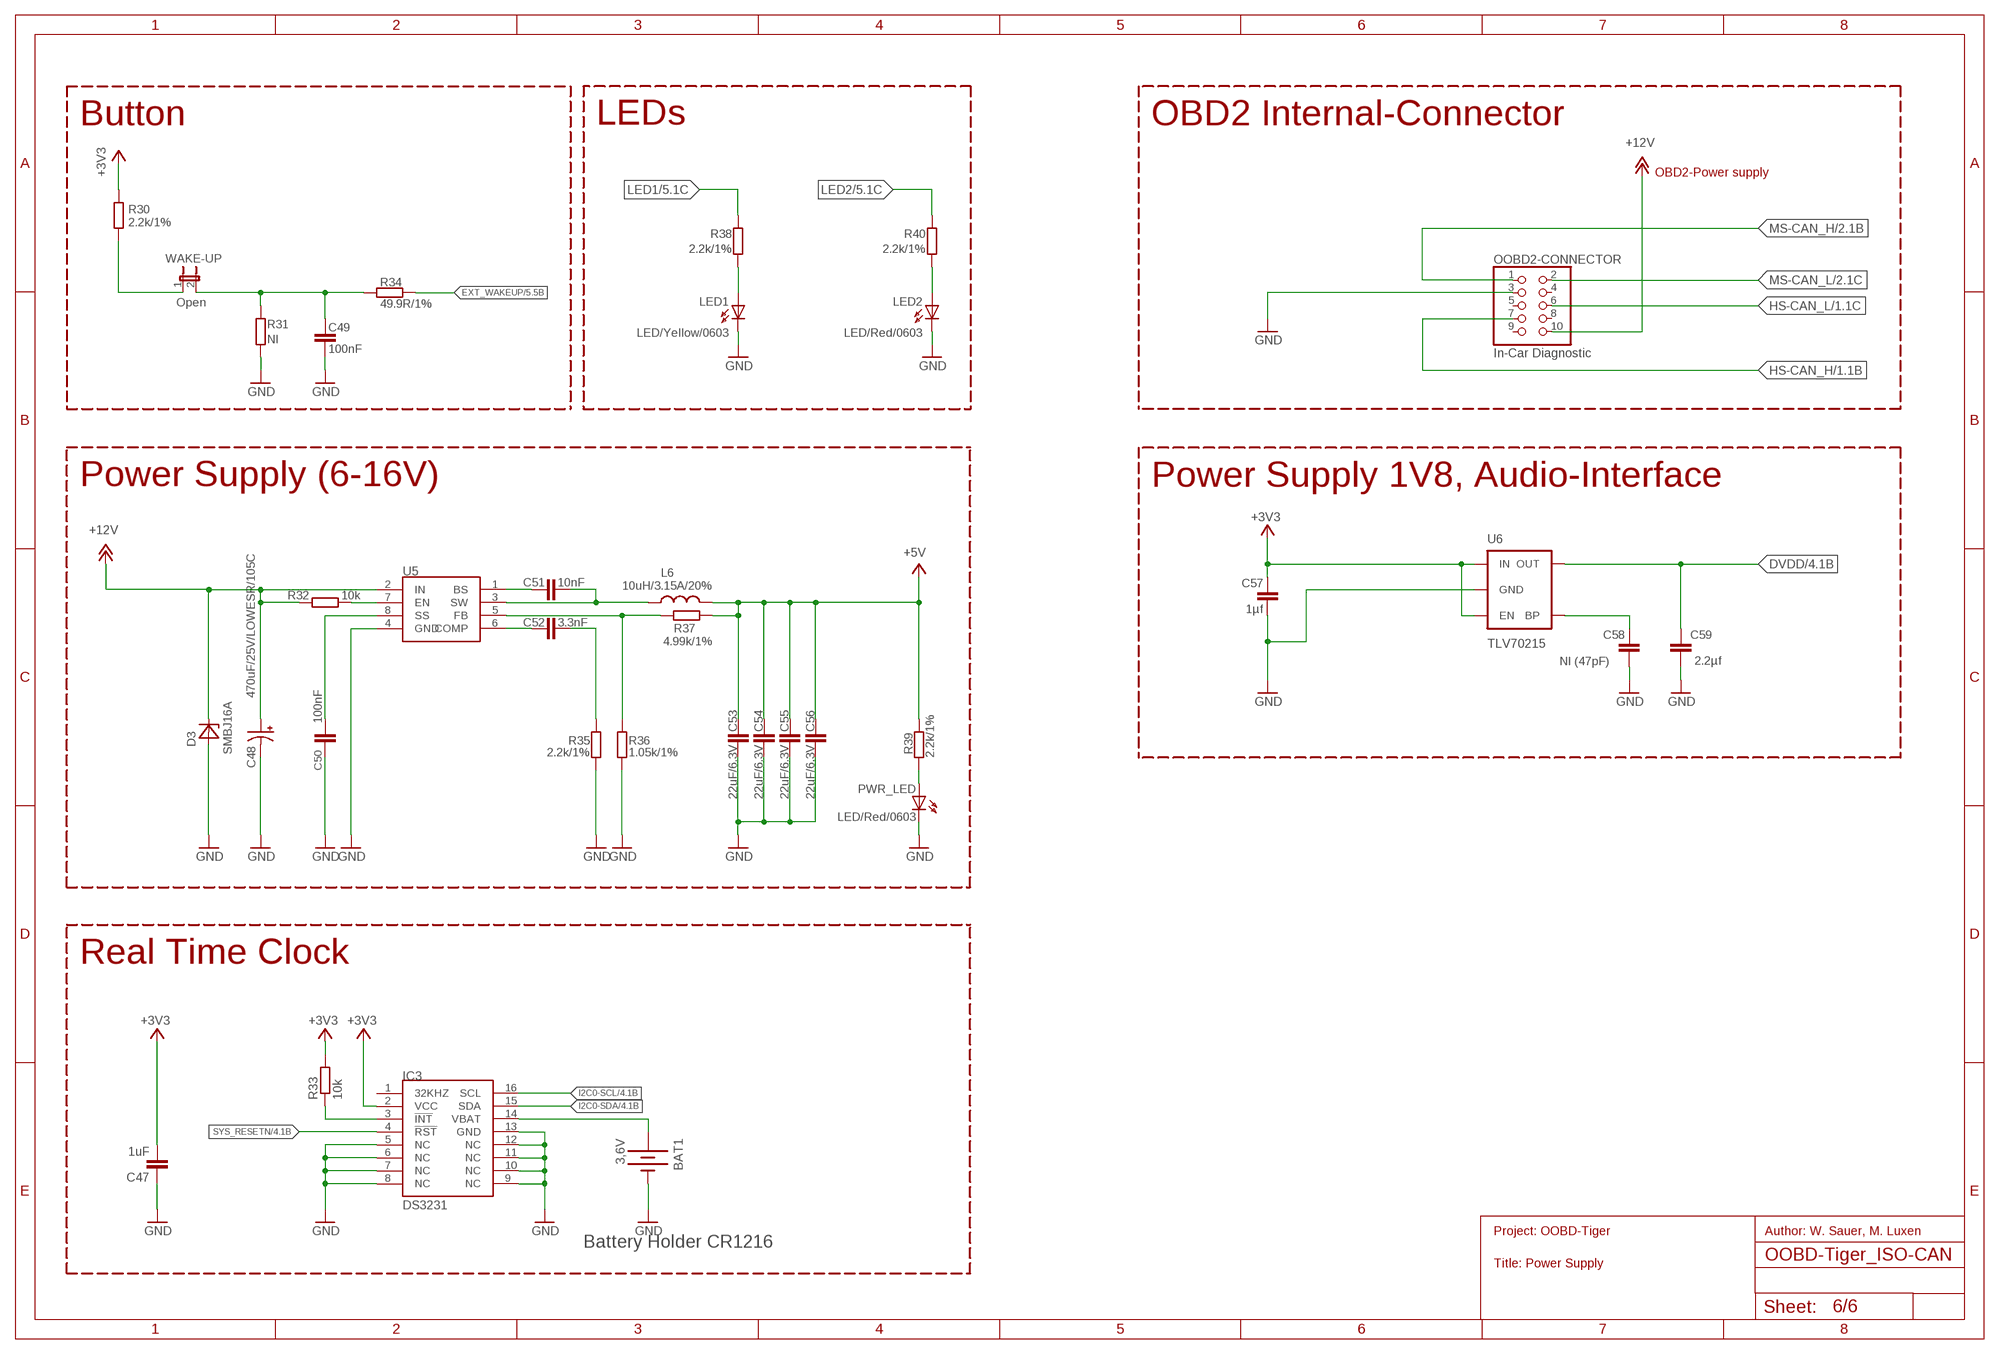
[diagram p5: schematic, sheet 6]

### Parts
BAT1  3,6V  BATTERY12PTH  [BATTCON_12MM_PTH]
C47  1uF  C-EUC0603  [C0603]
C48  470uF/25V/LOWESR/105C  47UF-50V-20%(ELECT)  [PANASONIC_D]
C49  100nF  C-EUC0603  [C0603]
C50  100nF  C-EUC0603  [C0603]
C51  10nF  C-EUC0603  [C0603]
C52  3.3nF  C-EUC0603  [C0603]
C53  22uF/6.3V  C-EUC0603  [C0603]
C54  22uF/6.3V  C-EUC0603  [C0603]
C55  22uF/6.3V  C-EUC0603  [C0603]
C56  22uF/6.3V  C-EUC0603  [C0603]
C57  1µf  CAP0603-CAP  [0603-CAP]
C58  NI (47pF)  CAP0603-CAP  [0603-CAP]
C59  2.2µf  CAP0603-CAP  [0603-CAP]
D3  SMBJ16A  [DO214AA]
IC3  DS3231  DS3231SOIC-16W  [SOIC-16W]
L6  10uH/3.15A/20%  LLQH88PN100M38  [8X8MM_3131]
LED1  LED/Yellow/0603  LEDLED_0603  [LED_0603]
LED2  LED/Red/0603  LEDLED_0603  [LED_0603]
OOBD2-CONNECTOR  In-Car Diagnostic  PINHD-2X5/90  [2X05/90]
PWR_LED  LED/Red/0603  LED0603DWS  [LED-0603]
R30  2.2k/1%  R-EU_R0603  [R0603]
R31  NI  R-EU_R0603  [R0603]
R32  10k  R-EU_R0603  [R0603]
R33  10k  R-EU_R0603  [R0603]
R34  49.9R/1%  R-EU_R0603  [R0603]
R35  2.2k/1%  R-EU_R0603  [R0603]
R36  1.05k/1%  R-EU_R0603  [R0603]
R37  4.99k/1%  R-EU_R0603  [R0603]
R38  2.2k/1%  R-EU_R0603  [R0603]
R39  2.2k/1%  R-EU_R0603  [R0603]
R40  2.2k/1%  R-EU_R0603  [R0603]
U5  MP1482  [SOIC8]
U6  TLV70215  V_REG_LDOSMD  [SOT23-5]
WAKE-UP  Open  JUMPER-2PTH_LOCK  [1X02_LOCK]

### Nets
+3V3: C47.2 C57.2 IC3.2(VCC) R30.2 R33.2 U6.1(IN) U6.3(EN) ; also sheet 1,2,4
+5V: C53.1 C54.1 C55.1 C56.1 L6.2 R37.2 R39.1 ; also sheet 1,2,3,4,5
+12V: C48.+ D3.C OOBD2-CONNECTOR.10 R32.1 U5.2(IN)
DVDD: C59.2 U6.5(OUT) ; also sheet 4
EXT_WAKEUP: R34.1 ; also sheet 5
GND [PWR]: BAT1.GND(-) C47.1 C48.- C49.2 C50.2 C53.2 C54.2 C55.2 C56.2 C57.1 C58.1 C59.1 D3.A IC3.5(NC) IC3.6(NC) IC3.7(NC) IC3.8(NC) IC3.9(NC) IC3.10(NC) IC3.11(NC) IC3.12(NC) IC3.13(GND) LED1.C LED2.C OOBD2-CONNECTOR.3 PWR_LED.C R31.2 R35.2 R36.2 U5.4(GND) U6.2(GND) ; also sheet 1,2,3,4,5
HS-CAN_H: OOBD2-CONNECTOR.7 ; also sheet 1
HS-CAN_L: OOBD2-CONNECTOR.6 ; also sheet 1
I2C0-SCL: IC3.16(SCL) ; also sheet 4,5
I2C0-SDA: IC3.15(SDA) ; also sheet 4,5
LED1: R38.1 ; also sheet 5
LED2: R40.1 ; also sheet 5
MS-CAN_H: OOBD2-CONNECTOR.1 ; also sheet 2
MS-CAN_L: OOBD2-CONNECTOR.2 ; also sheet 2
N$1: LED2.A R40.2
N$4: C50.1 U5.8(SS)
N$6: R32.2 U5.7(EN)
N$7: C51.1 U5.1(BS)
N$8: C51.2 L6.1 U5.3(SW)
N$9: C52.1 U5.6(COMP)
N$11: C52.2 R35.1
N$12: C58.2 U6.4(BP)
N$27: IC3.3(!INT) R33.1
N$43: R30.1 WAKE-UP.1
N$44: C49.1 R31.1 R34.2 WAKE-UP.2
N$62: R36.1 R37.1 U5.5(FB)
N$129: PWR_LED.A R39.2
N$231: LED1.A R38.2
SYS_RESETN: IC3.4(!RST) ; also sheet 4,5
VBAT: BAT1.VCC@1(+) IC3.14(VBAT)
Unconnected: IC3.1(32KHZ) OOBD2-CONNECTOR.4 OOBD2-CONNECTOR.5 OOBD2-CONNECTOR.8 OOBD2-CONNECTOR.9

### Notes on the sheet
- Button | LEDs | OBD2 Internal-Connector
- OBD2-Power supply
- Power Supply (6-16V) | Power Supply 1V8, Audio-Interface
- Ra
- Vout=0.923x(1+Ra/Rb)
- Rb
- Real Time Clock
- Project: OOBD-Tiger | Author: W. Sauer, M. Luxen
- Battery Holder CR1216
- Title: Power Supply

## Library data of the parts
AM3352-SOM-EVB-PLATFORM = OOBDtiger-Connector:OOBD-TIGER-AM3352-SOM: OOBD-Tiger AM3352-SOM Interface
BAT1 = SparkFun:BATTERY: Battery Holders Various common sizes : AA, AAA, 20mm coin cell and 12mm coin cell.
C1 C2 C4-C13 C15-C30 C47 C49-C56 = rcl:C-EU: CAPACITOR, European symbol
C3 C14 = resistor:C-EU: CAPACITOR, European symbol
C31 C32 C35-C40 C45 C46 C58 = SparkFun-Passives:CAP: Capacitor Standard 0603 ceramic capacitor, and 0.1" leaded capacitor.; MANEX: 123-0001115
C33 C34 C41-C44 C57 C59 = SparkFun-Passives:CAP: Capacitor Standard 0603 ceramic capacitor, and 0.1" leaded capacitor.; MANEX: 123-0001032
C48 = SparkFun-Capacitors:47UF-50V-20%(ELECT): CAP-10547; PROD_ID: CAP-10547
D1 D2 = Industrialberry:PESD1CAN
D3 = OLIMEX_DISCRET:SMBJ16A
HS-CAN MS-CAN WAKE-UP = SparkFun:JUMPER-2: Jumper Basic 0.1" spaced jumper. Use with breakaway headers.
IC1 IC2 = ADM3053:ADM3053: Signal and Power Isolated CAN Transceiver Analog Devices - Signal and Power Isolated CAN Transceiver with Integrated Isolated DC-to-DC Converter
IC3 = DS3231_industrialberry:DS3231
JP1 OOBDPICAN = jumper:JP3Q: JUMPER
L1-L5 = rcl:L-US: INDUCTOR, American symbol
L6 = OLIMEX_DISCRET:L
LED1 LED2 PWR_LED = DOUBLE-SIDE:LED
OOBD2-CONNECTOR = pinhead:PINHD-2X5: PIN HEADER
R1 R4-R8 R11-R25 R30-R41 = rcl:R-EU_: RESISTOR, European symbol
R2 R3 R9 R10 R28 R29 = resistor:R-EU_: RESISTOR, European symbol
R26 R27 = resistor:R-EU_: RESISTOR, European symbol; MANEX: 110-0002014
TLV320AIC1 = TLV320AIC3107:TLV320AIC3107
U1 U2 = arm:MCP2551
U3 U4 = OLIMEX_IC:SY6280
U5 = OLIMEX_IC:MP1482
U6 = SparkFun-PowerIC:V_REG_LDO: Voltage Regulator LDO Standard 150mA LDO voltage regulator in SOT-23 layout. Micrel part MIC5205. BP (by-pass) pin is used to lower output noise with 470pF cap.
USB_HOST = OLIMEX_CONNECTORS:USB_SHIELD
USB_OTG = OLIMEX_CONNECTORS:MINI_USB9

## Net classes
2 lan_sh: clearance 0.762 mm